# Altium project Robot-Design.PrjPcb
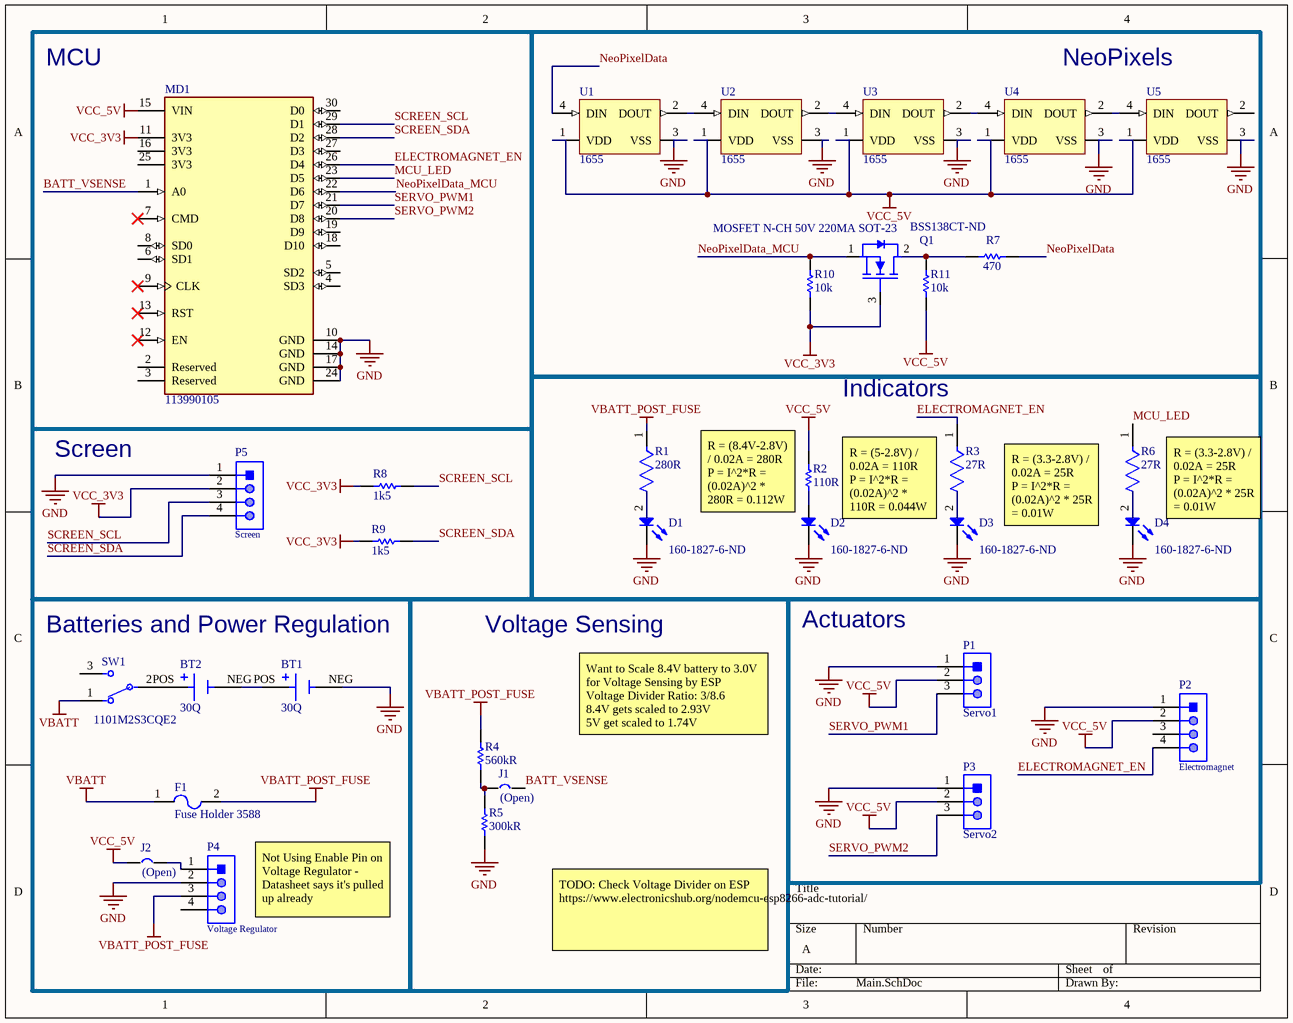
[diagram p0: Main.SchDoc]
1 sheet, 33 parts. Net scope: global (net labels, ports and power ports of the same name join across sheets).
Board file: ParrotPCB.PcbDoc

## Sheet Main.SchDoc
size A; SheetNumber: 1; SheetTotal: 1

### Parts
BT1  30Q  [BAT_BK-18650-PC2]
BT2  30Q  [BAT_BK-18650-PC2]
D1  Supplier Part Number 1: 160-1827-6-ND  [DIOC1608X04N]  (hidden comment: LED BLUE CLEAR CHIP SMD)
D2  Supplier Part Number 1: 160-1827-6-ND  [DIOC1608X04N]  (hidden comment: LED BLUE CLEAR CHIP SMD)
D3  Supplier Part Number 1: 160-1827-6-ND  [DIOC1608X04N]  (hidden comment: LED BLUE CLEAR CHIP SMD)
D4  Supplier Part Number 1: 160-1827-6-ND  [DIOC1608X04N]  (hidden comment: LED BLUE CLEAR CHIP SMD)
F1  Fuse Holder 3588  [Fuse Holder 3588]
J1  (Open)  [Solder Jumper]
J2  (Open)  [Solder Jumper]
MD1  113990105  [FP-113990105-MFG]
P1  Servo1  [MOLX-22-28-4033_V]
P2  Electromagnet  [61300411121]
P3  Servo2  [MOLX-22-28-4033_V]
P4  Voltage Regulator  [61300411121]
P5  Screen  [61300411121]
Q1  MOSFET N-CH 50V 220MA SOT-23  Supplier Part Number 1: BSS138CT-ND  [SOT90P240X110-3N]
R1  280R  [FP-RP73P-1J-MFG]
R2  110R  [RESC1609X50X30NL10T20]
R3  27R  [FP-ERJ3EK-MFG]
R4  560kR  [RESC1608X55X30NL15T15]
R5  300kR  [RESC1608X55X30ML15T15]
R6  27R  [FP-ERJ3EK-MFG]
R7  470  [RESC1608X55X30ML15T15]
R8  1k5  [RESC1608X55X25NL10T15]
R9  1k5  [RESC1608X55X25NL10T15]
R10  10k  [RESC1608X55X30ML15T15]
R11  10k  [RESC1608X55X30ML15T15]
SW1  1101M2S3CQE2  [FP-1101M2S3CQE2-MFG]
U1  1655  [ADA-RGB-1655_V]
U2  1655  [ADA-RGB-1655_V]
U3  1655  [ADA-RGB-1655_V]
U4  1655  [ADA-RGB-1655_V]
U5  1655  [ADA-RGB-1655_V]

### Blocks framed on the sheet
MCU: MD1
NeoPixels: Q1 R7 R10 R11 U1-U5
Indicators: D1-D4 R1-R3 R6
Screen: P5 R8 R9
Batteries and Power Regulation: BT1 BT2 F1 J2 P4 SW1
Voltage Sensing: J1 R4 R5
Actuators: P1-P3

### Nets
GND: BT1.NEG D1.1(K) D2.1(K) D3.1(K) D4.1(K) MD1.10(GND) MD1.14(GND) MD1.17(GND) MD1.24(GND) P1.1 P2.1 P3.1 P4.2 P5.1 R5.1 U1.3(VSS) U2.3(VSS) U3.3(VSS) U4.3(VSS) U5.3(VSS)
VBATT: F1.1 SW1.1
VBATT_POST_FUSE: F1.2 P4.3 R1.1 R4.2
VCC_3V3: MD1.11(3V3) P5.2 Q1.3(G) R8.2 R9.2 R10.2
VCC_5V: J2.1 MD1.15(VIN) P1.2 P2.2 P3.2 R2.2 R11.2 U1.1(VDD) U2.1(VDD) U3.1(VDD) U4.1(VDD) U5.1(VDD)
BATT_VSENSE: J1.2 MD1.1(A0)
ELECTROMAGNET_EN: MD1.26(D4) P2.4 R3.1
MCU_LED: MD1.23(D5) R6.1
NeoPixelData: R7.1 U1.4(DIN)
NeoPixelData_MCU: MD1.22(D6) Q1.1(D) R10.1
SCREEN_SCL: MD1.29(D1) P5.3 R8.1
SCREEN_SDA: MD1.28(D2) P5.4 R9.1
SERVO_PWM1: MD1.21(D7) P1.3
SERVO_PWM2: MD1.20(D8) P3.3
NetBT1_POS: BT1.POS BT2.NEG
NetBT2_POS: BT2.POS SW1.2(COMM)
NetD1_2: D1.2(A) R1.2
NetD2_2: D2.2(A) R2.1
NetD3_2: D3.2(A) R3.2
NetD4_2: D4.2(A) R6.2
NetJ1_1: J1.1 R4.1 R5.2
NetJ2_2: J2.2 P4.1
NetQ1_2: Q1.2(S) R7.2 R11.1
NetU1_2: U1.2(DOUT) U2.4(DIN)
NetU2_2: U2.2(DOUT) U3.4(DIN)
NetU3_2: U3.2(DOUT) U4.4(DIN)
NetU4_2: U4.2(DOUT) U5.4(DIN)

Not connected (* = marked no-connect by the designer): MD1 2(Reserved) 3(Reserved) 4(SD3) 5(SD2) 6(SD1) 7(CMD)* 8(SD0) 9(CLK)* 12(EN)* 13(RST)* 16(3V3) 18(D10) 19(D9) 25(3V3) 27(D3) 30(D0); P2 3; P4 4; SW1 3; U5 2(DOUT)

### Notes on the sheet
- R = (8.4V-2.8V) / 0.02A = 280R
  P = I^2*R = (0.02A)^2 * 280R = 0.112W
- R = (5-2.8V) / 0.02A = 110R
  P = I^2*R = (0.02A)^2 * 110R = 0.044W
- R = (3.3-2.8V) / 0.02A = 25R
  P = I^2*R = (0.02A)^2 * 25R = 0.01W
- Want to Scale 8.4V battery to 3.0V for Voltage Sensing by ESP
  Voltage Divider Ratio: 3/8.6
  8.4V gets scaled to 2.93V
  5V get scaled to 1.74V
- Not Using Enable Pin on Voltage Regulator - Datasheet says it's pulled up already
- TODO: Check Voltage Divider on ESP
  https://www.electronicshub.org/nodemcu-esp8266-adc-tutorial/

### Library data of the parts
BT1 BT2 = BK-18650-PC2: Battery Holder (Open) 18650 1 Cell PC Pin; Price: None; Value: *; Package: None; Availability: Unavailable; MP: BK-18650-PC2
D1-D4 = LTST-C193TBKT-5A: Blue 470nm LED Indication - Discrete 2.8V 0603 (1608 Metric); Supplier 1: Digi-Key
F1 = 3588 Fuse Holder: Keystone Electronics 3588; Supplier 1: Digi-Key; Supplier Part Number 1: 36-3588-ND; Datasheet: http://keyelco.com/userAssets/file/M65p43.pdf
J1 J2 = Jumper
MD1 = CMP-138991-000001-1: NODEMCU V2 LUA BASED ESP8266 DEV; Frequency: 2.4GHz; Series: -
P1 P3 = CMP-1676-00001-5: Male Header, Pitch 2.54 mm, 1 x 3 Position, Height 8.38 mm, Tail Length 3.18 mm, RoHS, Bulk; Manufacturer: Molex; Rows: 1; Voltage Rating: 250 V; Current Rating: 4 A; Min Operating Temperature: 0 degC; Lead Pitch: 0.1 inch; Packaging: Bulk; Contact Finish: Gold; RoHSCompliant: true; Contact Material: Brass; PackageReference: 22-28-4033; REACH SVHC: Unknown; PackageDescription: Male Header, Pitch 2.54 mm, 1 x 3 Position, Height 8.38 mm, Tail Length 3.18 mm; ComponentLink2URL: http://www.molex.com/pdm_docs/sd/022284033_sd.pdf; Height: 8.38 mm; Mounting Technology: Through Hole; ComponentLink1Description: Manufacturer URL; Length: 7.62 mm; Mount: Through Hole; DatasheetVersion: Rev. G, 01/2012; Max Operating Temperature: 75 degC; ComponentLink2Description: Datasheet; Colour: Black; Pins: 3; Contact Plating: Gold; Package Quantity: 1; ComponentLink1URL: http://www.molex.com/
P2 P4 P5 = CMP-1502-01064-1: THT Vertical Pin Header WR-PHD, Pitch 2.54 mm, Single Row, 4 pins; Manufacturer: Wurth Elektronik; Withstanding Voltage: 500VAC; Rated Current: 3A; Working Voltage: 250VAC; Pin Number: 4; Gender: Male; Contact Resistance: 20mOhm; Pitch: 2.54mm; Manufacturer URL: http://www.we-online.de; Operating Temperature: -40to105degC; Packaging: Bag; Mounting Technology: THT; Package Reference: 61300411121; Datasheet URL: https://katalog.we-online.de/em/datasheet/6130xx11121.pdf; Publisher: WurthElektronik; Part Number: 61300411121; Row Number: Single; Orientation: Vertical
Q1 = BSS138 Fairchild: N-Channel 220mA (Ta) 360mW (Ta) Surface Mount SOT-23-3; Supplier 1: Digi-Key
R1 = CMP-03211-006365-1: RES SMD 280 OHM 0.1% 1/6W 0603; Manufacturer Part Number: RP73PF1J280RBTDF; Manufacturer: TE Connectivity; Voltage Rating: 100V; Temperature Coefficient: 25ppm/°C; Value: 280Ω; Tolerance: 0.001; Power Rating: 0.166W; Ipc Land Pattern Name: RESC15580X45; Temperature: -55°C to +155°C; Temperature Range Low: -55°C; Height: 0.55mm; Series: RP73P; Package: RP73P-1J; Automotive: No; ComponentLink2URL: https://www.te.com/commerce/DocumentDelivery/DDEController?Action=srchrtrv&DocNm=1773272&DocType=DS&DocLang=English; Device Class L2: Resistors; Device Class L3: Chip SMD Resistors; Digikey Description: RES SMD 280 OHM 0.1% 1/6W 0603; Temperature Range High: +155°C; Resistance: 280Ω; ComponentLink2Description: Datasheet; Category: Res; Device Class L1: Passive Components; RoHS: TRUE; Octopart: https://octopart.com/rp73pf1j280rbtdf-te+connectivity-45465887; Composition: Thin Film; Lead Free: Yes
R2 = CMP-2000-03854-1: Part Number: CRCW0603110RFKEA; Manufacturer: Vishay Dale
R3 R6 = CMP-2000-00396-2: RES SMD 27 OHM 1% 1/10W 0603; Max Power Dissipation: 100mW; Voltage Rating: 75V; Temperature Coefficient: 100ppm/°C; Number of Pins: 2; Case Code (Imperial): 0603; Resistance Tolerance: 1%; Max Operating Temperature: 155°C; Min Operating Temperature: -55°C; Resistance: 27R; Termination: SMD/SMT; Length: 1.6mm; Resistor Type: Thick Film; Tolerance: 1%; Packaging: Tape and Reel; Radiation Hardening: No; Series: ERJ; Depth: 0.8mm; RoHS Compliant: Yes; Lead Free: Lead Free; Height: 0.022inch; Width: 0.031inch; Mount: Surface Mount; Contact Plating: Tin; Number of Terminations: 2; Features: Automotive AEC-Q200; Military Standard: Not; Power Rating: 100mW; Package Quantity: 1; Case/Package: 0603; Construction: Rectangular; Voltage Rating (DC): 75V; Case Code (Metric): 1608
R4 = CMP-2000-00567-1: Manufacturer: Panasonic; Part Number: ERJ3EKF5603V
R5 = CMP-2000-00414-1: Part Number: ERJ-3EKF3003V; Manufacturer: Panasonic
R7 R10 R11 = CMP-2000-00412-1: Manufacturer: Panasonic; Part Number: ERJ-3EKF3001V
R8 R9 = CMP-1012-00595-2: Chip Resistor, 5.6 KOhm, +/- 1%, 0.1 W, -55 to 155 degC, 0603 (1608 Metric), RoHS, Tape and Reel; Voltage Rating: 50 V; Case\Package: 0603; Power Rating: 100 mW; Type (Resistor): Thick Film; Resistance: 332 kohm; ComponentLink1Description: Manufacturer URL; Case Code (Metric): 1608; Height: 0.45 mm; Min Operating Temperature: -55 degC; RoHSCompliant: true; ComponentLink2URL: http://www.yageo.com/documents/recent/PYu-RC_Group_51_RoHS_L_04.pdf; Length: 1.6 mm; ComponentLink2Description: Datasheet; Width: 0.8 mm; PackageReference: 0603; DatasheetVersion: Rev. 4, 02/2016; Package Quantity: 5000; Tolerance: 1%; Case Code (Imperial): 0603; PackageDescription: 2-Pin Surface Mount Device, Body 1.6 x 0.8 mm; ComponentLink1URL: http://www.yageo.com/; Max Operating Temperature: 155 degC; Packaging: Tape and Reel
SW1 = CMP-10038-000019-1: SWITCH SLIDE SPDT 6A 120V; Switch Travel: 2.16mm; Number of Positions: 3; Number of Poles: 1; Approvals: UL; Actuator Length: 5.08mm; Voltage Rating (DC): 28V; Max Voltage Rating (AC): 250V; Insulation Resistance: 1GR; Body Material: Stainless Steel; Actuator Type: Standard; Contact Resistance: 10mR; Switch Function: On-On; Actuator Material: Nylon; Actuator Color: Black; Electrical Life: 40000Cycles; Termination: PC Pins; Packaging: Bulk; Housing Material: Stainless Steel; Flammability Rating: UL94 V-0; Series: 1000; Contact Current Rating: 6A; Length: 12.7mm; Depth: 6.6mm; Orientation: Vertical; Max Current Rating: 6A; Max Operating Temperature: 65°C; Throw Configuration: SPDT; REACH SVHC: No SVHC; Contact Material: Copper; Max Voltage Rating (DC): 28V; Lead Free: Lead Free; Current Rating: 6A; Voltage Rating (AC): 120V; Contact Plating: Silver; Package Quantity: 1; Min Operating Temperature: -30°C; Mount: Through Hole
U1-U5 = CMP-2000-05026-1: Intelligent Control LED Integrated Light Source, 3.5 to 5.3 V, -25 to 80 degC, 4-Pin SMD, RoHS, Tape and Reel; Manufacturer: Adafruit-Industries-LLC; Number of LEDs: 10; Configuration: Discrete; Utilized LED: WS2812(5050); Datasheet URL: http://datasheet.octopart.com/ADA1655-Adafruit-Industries-datasheet-32028139.pdf; Series: Neopixel; Interface: -; Package Description: 4-Pin Surface Mount Device, Body 5 x 5 mm; Color: Red,Green,Blue(RGB); Category: Optoelectronics; Controller Type: -; Package Reference: 1655; Manufacturer URL: https://www.adafruit.com/; Mounting Type: SurfaceMount; Datasheet Version: May-13; Size / Dimension: 5.00mmLx5.00mmW; Family: Addressable,Specialty